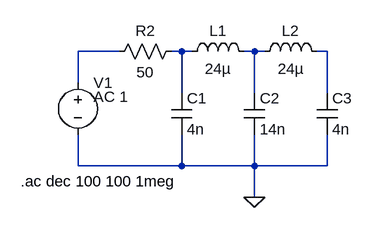
[diagram p0: schematic Filter.asc]
Filter.asc, the LTspice schematic file:
Version 4
SHEET 1 880 680
WIRE 304 -240 240 -240
WIRE 400 -240 384 -240
WIRE 416 -240 400 -240
WIRE 512 -240 496 -240
WIRE 528 -240 512 -240
WIRE 624 -240 608 -240
WIRE 240 -192 240 -240
WIRE 400 -176 400 -240
WIRE 512 -176 512 -240
WIRE 624 -176 624 -240
WIRE 240 -64 240 -112
WIRE 400 -64 400 -112
WIRE 400 -64 240 -64
WIRE 512 -64 512 -112
WIRE 512 -64 400 -64
WIRE 624 -64 624 -112
WIRE 624 -64 512 -64
WIRE 512 -16 512 -64
FLAG 512 -16 0
SYMBOL cap 384 -176 R0
SYMATTR InstName C1
SYMATTR Value 4n
SYMBOL cap 496 -176 R0
SYMATTR InstName C2
SYMATTR Value 14n
SYMBOL res 400 -256 R90
WINDOW 0 0 56 VBottom 2
WINDOW 3 32 56 VTop 2
SYMATTR InstName R2
SYMATTR Value 50
SYMBOL cap 608 -176 R0
SYMATTR InstName C3
SYMATTR Value 4n
SYMBOL voltage 240 -208 R0
WINDOW 123 24 38 Left 2
WINDOW 39 0 0 Left 2
SYMATTR InstName V1
SYMATTR Value ""
SYMATTR Value2 AC 1
SYMBOL ind 400 -224 R270
WINDOW 0 32 56 VTop 2
WINDOW 3 5 56 VBottom 2
SYMATTR InstName L1
SYMATTR Value 24µ
SYMBOL ind 512 -224 R270
WINDOW 0 32 56 VTop 2
WINDOW 3 5 56 VBottom 2
SYMATTR InstName L2
SYMATTR Value 24µ
TEXT 152 -40 Left 2 !.ac dec 100 100 1meg

The netlist it stands for:
* Filter.asc
C1 N002 0 4n
C2 N003 0 14n
R2 N002 N001 50
C3 N004 0 4n
V1 N001 0 AC 1
L1 N002 N003 24µ
L2 N003 N004 24µ
.ac dec 100 100 1meg
.backanno
.end